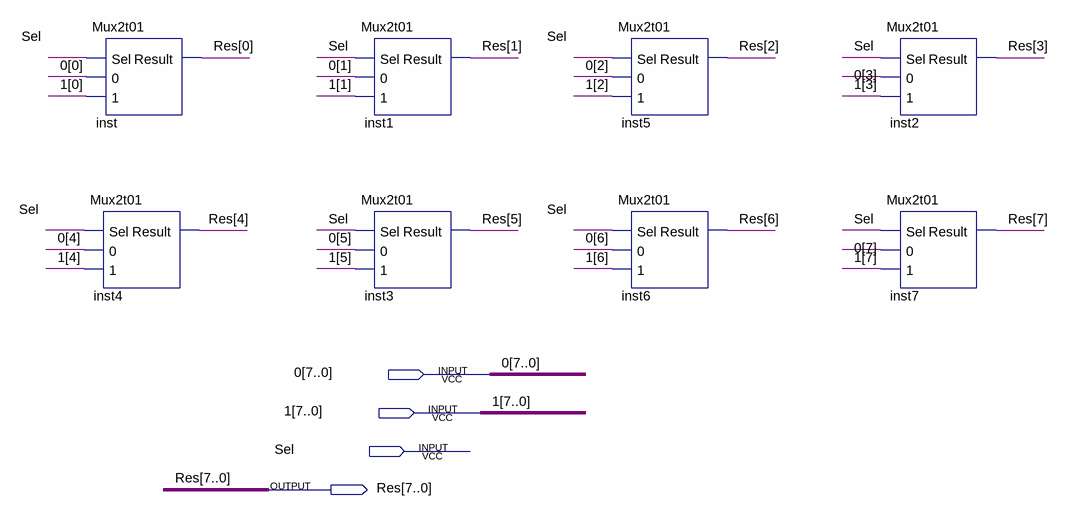
[diagram p0: schematic sheet]
// Quartus schematic 8Mux2to1.bdf as structural Verilog: 8 symbols, 4 pins
module \8Mux2to1  (
  input  [7:0] \0 ,
  input  [7:0] \1 ,
  input  Sel,
  output [7:0] Res
);

  Mux2t01 inst (.Sel(Sel), .\0 (\0 [0]), .\1 (\1 [0]), .Result(Res[0]));
  Mux2t01 inst4 (.Sel(Sel), .\0 (\0 [4]), .\1 (\1 [4]), .Result(Res[4]));
  Mux2t01 inst1 (.Sel(Sel), .\0 (\0 [1]), .\1 (\1 [1]), .Result(Res[1]));
  Mux2t01 inst3 (.Sel(Sel), .\0 (\0 [5]), .\1 (\1 [5]), .Result(Res[5]));
  Mux2t01 inst5 (.Sel(Sel), .\0 (\0 [2]), .\1 (\1 [2]), .Result(Res[2]));
  Mux2t01 inst6 (.Sel(Sel), .\0 (\0 [6]), .\1 (\1 [6]), .Result(Res[6]));
  Mux2t01 inst2 (.Sel(Sel), .\0 (\0 [3]), .\1 (\1 [3]), .Result(Res[3]));
  Mux2t01 inst7 (.Sel(Sel), .\0 (\0 [7]), .\1 (\1 [7]), .Result(Res[7]));
endmodule
